# Altium schematic sheet HVSUP_channel.SchDoc
size A4
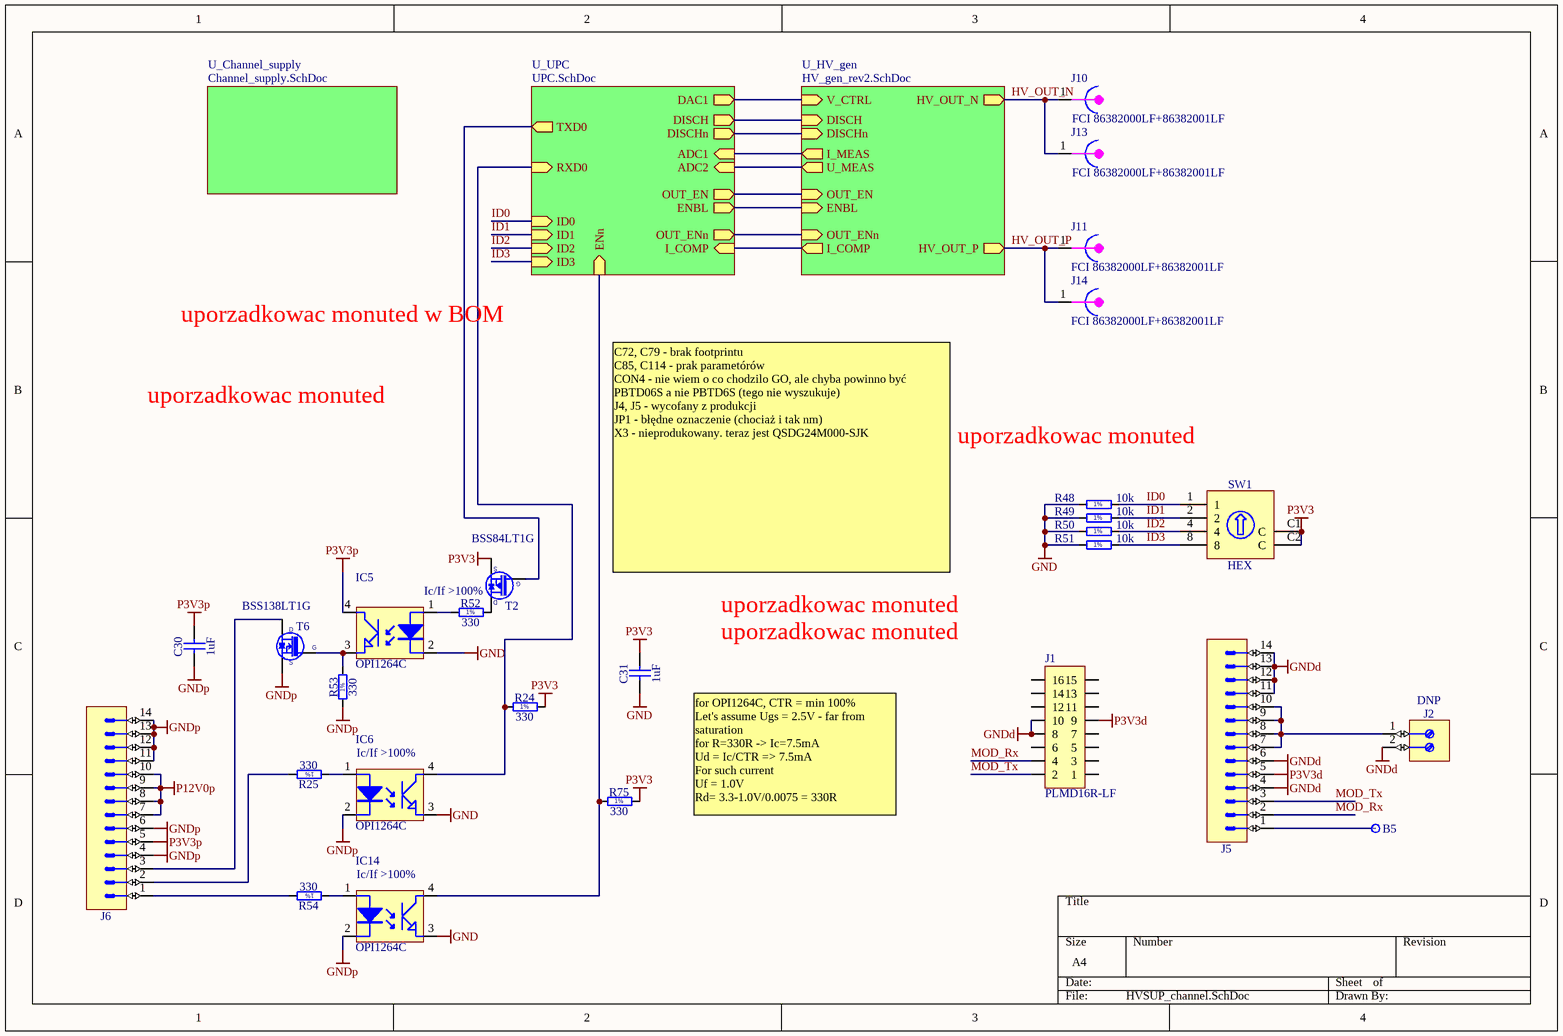
[diagram p0: HVSUP_channel.SchDoc]

## Parts
B5  Plated Hole  [c130h80]  (value not drawn)
C30  1uF  [CAPC1005X55N]
C31  1uF  [CAPC1005X55N]
IC5  OPI1264C  [OPI1264C]
IC6  OPI1264C  [OPI1264C]
IC14  OPI1264C  [OPI1264C]
J1  PLMD16R-LF  [PLMD16R-LF]
J2  DNP  [PHOENIX_1725656]
J5  Header 14  [3M_N2514-5002RB]  (value not drawn)
J6  Header 14  [3M_N2514-5002RB]  (value not drawn)
J10  FCI 86382000LF+86382001LF  [FCI_86382000LF]
J11  FCI 86382000LF+86382001LF  [FCI_86382000LF]
J13  FCI 86382000LF+86382001LF  [FCI_86382000LF]
J14  FCI 86382000LF+86382001LF  [FCI_86382000LF]
R24  330  [RESC1005X40N]
R25  330  [RESC1005X40N]
R48  10k  [RESC1005X40N]
R49  10k  [RESC1005X40N]
R50  10k  [RESC1005X40N]
R51  10k  [RESC1005X40N]
R52  330  [RESC1005X40N]
R53  330  [RESC1005X40N]
R54  330  [RESC1005X40N]
R75  330  [RESC1005X40N]
SW1  HEX  [SW_OMRON_A6RV-162RF]
T2  BSS84LT1G  [SOT95P240X110-3N]
T6  BSS138LT1G  [SOT95P240X110-3N]

## Sub-sheets
U_Channel_supply = Channel_supply.SchDoc: no entries
U_HV_gen = HV_gen_rev2.SchDoc: HV_OUT_P (out), HV_OUT_N (out), ENBL (in), V_CTRL (in), I_MEAS (out), U_MEAS (out), OUT_EN (in), OUT_ENn (in), I_COMP (out), DISCH (in), DISCHn (in)
U_UPC = UPC.SchDoc: ADC1 (in), ADC2 (in), DAC1 (out), TXD0 (out), RXD0 (in), ENBL (out), ID0 (in), ID1 (in), ID2 (in), ID3 (in), OUT_EN (out), ENn (in), OUT_ENn (out), I_COMP (in), DISCH (out), DISCHn (out)

## Nets
GND: C31.1 IC5.2(K) IC6.3(E) IC14.3(E) R48.1 R49.1 R50.1 R51.1
GNDd: J1.8 J1.10 J2.2 J5.4 J5.6 J5.11 J5.12 J5.13 J5.14
GNDp: C30.1 IC6.2(K) IC14.2(K) J6.4 J6.6 J6.11 J6.12 J6.13 J6.14 R53.1 T6.2(S)
P3V3: C31.2 R24.2 R75.2 SW1.C1(C) SW1.C2(C) T2.2(S)
P3V3d: J1.9 J5.5
P3V3p: C30.2 IC5.4(C) J6.5
P12V0p: J6.7 J6.8 J6.9 J6.10
HV_OUT_N: J10.1 J13.1 ; sheet U_HV_gen/HV_OUT_N
HV_OUT_P: J11.1 J14.1 ; sheet U_HV_gen/HV_OUT_P
ID0: R48.2 SW1.1 ; sheet U_UPC/ID0
ID1: R49.2 SW1.2 ; sheet U_UPC/ID1
ID2: R50.2 SW1.4 ; sheet U_UPC/ID2
ID3: R51.2 SW1.8 ; sheet U_UPC/ID3
MOD_Rx: J1.4 J5.2
MOD_Tx: J1.2 J5.3
NetB5_1: B5.1 J5.1
NetIC5_1: IC5.1(A) R52.1
NetIC5_3: IC5.3(E) R53.2 T6.1(G)
NetIC6_1: IC6.1(A) R25.1
NetIC6_4: IC6.4(C) R24.1 ; sheet U_UPC/RXD0
NetIC14_1: IC14.1(A) R54.1
NetIC14_4: IC14.4(C) R75.1 ; sheet U_UPC/ENn
NetJ2_1: J2.1 J5.7 J5.8 J5.9 J5.10
NetJ6_1: J6.1 R54.2
NetJ6_2: J6.2 R25.2
NetJ6_3: J6.3 T6.3(D)
NetR52_2: R52.2 T2.3(D)
NetT2_1: T2.1(G) ; sheet U_UPC/TXD0
(unnamed): sheet U_UPC/ADC1, sheet U_HV_gen/I_MEAS
(unnamed): sheet U_UPC/ADC2, sheet U_HV_gen/U_MEAS
(unnamed): sheet U_UPC/DAC1, sheet U_HV_gen/V_CTRL
(unnamed): sheet U_UPC/ENBL, sheet U_HV_gen/ENBL
(unnamed): sheet U_UPC/OUT_EN, sheet U_HV_gen/OUT_EN
(unnamed): sheet U_UPC/OUT_ENn, sheet U_HV_gen/OUT_ENn
(unnamed): sheet U_UPC/I_COMP, sheet U_HV_gen/I_COMP
(unnamed): sheet U_UPC/DISCH, sheet U_HV_gen/DISCH
(unnamed): sheet U_UPC/DISCHn, sheet U_HV_gen/DISCHn

Not connected (* = marked no-connect by the designer): J1 1 3 5 6 7 11 12 13 14 15 16

## Notes on the sheet
- uporzadkowac monuted w BOM
- uporzadkowac monuted
- C72, C79 - brak footprintu
  C85, C114 - prak parametórów
  CON4 - nie wiem o co chodzilo GO, ale chyba powinno być PBTD06S a nie PBTD6S (tego nie wyszukuje)
  J4, J5 - wycofany z produkcji
  JP1 - błędne oznaczenie (chociaż i tak nm)
  X3 - nieprodukowany. teraz jest QSDG24M000-SJK
- for OPI1264C, CTR = min 100%
  Let's assume Ugs = 2.5V - far from saturation
  for R=330R -> Ic=7.5mA
  Ud = Ic/CTR => 7.5mA
  For such current
  Uf = 1.0V
  Rd= 3.3-1.0V/0.0075 = 330R
- (in symbol OPTO-OPI1264C) Ic/If >100%
- (in symbol R0402_10K_1%_0.0625W_100PPM) 1%
- (in symbol R0402_330R_1%_0.0625W_100PPM) 1%

## Library data of the parts
B5 = PLATED_HOLE0.8_PAD1.3: Single Terminal Socket; Part Description: Plated Through Hole: Hole Dia.=0.8mm Pad Dia.=1.3mm; Mounted: No; Part Number: PLATED_HOLE0.8_PAD1.3; Component Kind: Standard (No BOM); Component Type: Standard (No BOM); Pin Count: 1; Family: Plated Hole; Socket: No; SMD: No; Sense: No; Status: None; ComponentHeight: 0mm; HelpURL: Undefined; Author: CERN DEM JLC; CreateDate: 2008-10-30; LatestRevisionDate: 2008-10-30; PackageDescription: Plated Through Hole: Hole Dia.=0.8mm Pad Dia.=1.3mm
C30 C31 = CC0402_1UF_16V_10%_X5R: Non-polarised capacitor; Part Description: SMD Multilayer Chip Ceramic Capacitor; Manufacturer: GENERIC; Manufacturer1 Part Number: C1005X5R1C105KT; Voltage: 16V; TC: X5R; Tolerance: ±10%; Part Number: CC0402_1UF_16V_10%_X5R; Component Kind: Standard; Component Type: Standard; Pin Count: 2; Value: 1uF; Status: Preferred; Manufacturer Part Number: CC0402_1UF_16V_10%_X5R; Case: 0402; Mounted: Yes; Socket: No; SMD: Yes; Sense: No; Manufacturer1 Example: TDK; Manufacturer1 ComponentHeight: 0.55mm; HelpURL: \\cern.ch\dfs\Applications\Altium\Datasheets\CC0402_X5R_TDK_C.pdf; Author: CERN DEM JLC; CreateDate: 2012-10-25; LatestRevisionDate: 2012-10-25
IC5 IC6 IC14 = OPTO-OPI1264C: 10kV opto-coupler; Supplier 1: Newark; Supplier Part Number 1: 08F2863
J1 = CON_2x8 2mm_RA_male: 2mm  dual row goldpin (Maritex)
J2 = PHOENIX_1725656: Terminal Block, 2 Positions, Screw Connection; Part Description: 6A, 63V, Terminal Block, Pitch 2.54mm, 2 Positions, Screw Connection; Manufacturer: PHOENIX CONTACT; Manufacturer Part Number: 1725656 (MPT 0,5/2-2,54); PressFit: No; Part Number: PHOENIX_1725656; Component Kind: Standard; Component Type: Standard; Pin Count: 2; Mounted: Yes; Socket: No; SMD: No; Sense: No; Status: None; ComponentHeight: 8.5mm; HelpURL: \\cern.ch\dfs\Applications\Altium\Datasheets\PHOENIX_1725656.pdf; Author: CERN DEM JMW; CreateDate: 2008-11-07; LatestRevisionDate: 2010-04-26
J5 J6 = 3M_N2514-5002RB: Connector 14 Male; Part Description: 14 Contacts - Right Angle .100" x .100" Low Profile Four-Wall Header, 2500 Series; Manufacturer: 3M; PressFit: No; Part Number: 3M_N2514-5002RB; Component Kind: Standard; Component Type: Standard; Pin Count: 14; Family: Header 14; Mounted: Yes; Socket: No; SMD: No; Sense: No; Status: None; Manufacturer Part Number: N2514-5002RB; ComponentHeight: 8.59mm; HelpURL: \\cern.ch\dfs\Applications\Altium\Datasheets\3M_N2514-5002RB.pdf; Author: CERN DEM JLC; CreateDate: 2008-10-29; LatestRevisionDate: 2012-01-16
J10 J11 J13 J14 = CON_HV_DSUB_PIN: D-SUB HIGH VOLTAGE CONTACT PIN
R24 R25 R52-R54 R75 = R0402_330R_1%_0.0625W_100PPM: Resistor - 1%; Part Description: General Purpose Thick Film Chip Resistor; Manufacturer: GENERIC; Manufacturer1 Part Number: 232270673301L; TC: ±100ppm/°C; Part Number: R0402_330R_1%_0.0625W_100PPM; Component Kind: Standard; Component Type: Standard; Pin Count: 2; Value: 330; Status: Not recommended; Power: 0.0625W; Tolerance: ±1%; Manufacturer Part Number: R0402_330R_1%_0.0625W_100PPM; Case: 0402; Mounted: Yes; Sense: No; Socket: No; SMD: Yes; Manufacturer1 Example: YAGEO PHYCOMP; Manufacturer1 ComponentHeight: 0.4mm; HelpURL: \\cern.ch\dfs\Applications\Altium\Datasheets\R0402_Phycomp_RC0402.pdf; Author: CERN DEM JLC; CreateDate: 2007-12-03; LatestRevisionDate: 2012-10-17
R48-R51 = R0402_10K_1%_0.0625W_100PPM: Resistor - 1%; Part Description: General Purpose Thick Film Chip Resistor; Manufacturer: GENERIC; Manufacturer1 Part Number: 232270671003L; TC: ±100ppm/°C; Part Number: R0402_10K_1%_0.0625W_100PPM; Component Kind: Standard; Component Type: Standard; Pin Count: 2; Value: 10k; Status: Not recommended; Power: 0.0625W; Tolerance: ±1%; Manufacturer Part Number: R0402_10K_1%_0.0625W_100PPM; Case: 0402; Mounted: Yes; Sense: No; Socket: No; SMD: Yes; Manufacturer1 Example: YAGEO PHYCOMP; Manufacturer1 ComponentHeight: 0.4mm; HelpURL: \\cern.ch\dfs\Applications\Altium\Datasheets\R0402_Phycomp_RC0402.pdf; Author: CERN DEM JLC; CreateDate: 2007-12-03; LatestRevisionDate: 2012-10-17
SW1 = SW_OMRON_A6RV-162RF: Rotary Code Switch 1 2 4 8 C1 C2; Part Number: SW_OMRON_A6RV-162RF or ERD716RR; Part Description: Side Actuated, Hexadecimal Rotary Code Switch; Manufacturer: OMRON; Manufacturer Part Number: A6RV-162RF or ERD716RR; PressFit: No; Component Kind: Standard; Component Type: Standard; Pin Count: 6; PackageDescription: Body 9.8x6.64mm, Side Actuated, Rotary Code Switch, OMRON A6RV Series; Family: HEX; Mounted: Yes; Socket: No; SMD: No; Sense: No; Status: None; ComponentHeight: 9.9mm; HelpURL: \\cern.ch\dfs\Applications\Altium\Datasheets\SW_OMRON_A6RV.pdf; Author: CERN DEM JLC; CreateDate: 2008-11-27; LatestRevisionDate: 2011-01-19
T2 = BSS84LT1G: P-CHANNEL MOSFET WITH DIODE; Part Description: 50V 130mA Single P-Channel Power MOSFET; Manufacturer: ON SEMICONDUCTOR; PressFit: No; Bonding: No; Part Number: BSS84LT1G; Component Kind: Standard; Component Type: Standard; Device: BSS84LT1G; PackageDescription: SOT23 3-Leads, Pitch 0.95mm - Body 1.4x3mm, IPC Medium Density; Manufacturer Part Number: BSS84LT1G; Pin Count: 3; Case: SOT23-3; Mounted: Yes; Socket: No; SMD: Yes; Sense: No; ComponentHeight: 1.1mm; HelpURL: \\cern.ch\dfs\Applications\Altium\Datasheets\BSS84LT1G.pdf; Author: CERN DEM JLC; CreateDate: 2012-03-29; LatestRevisionDate: 2012-03-29
T6 = BSS138LT1G: N-CHANNEL MOSFET WITH DIODE; Part Description: 50V 200mA N-Channel Enhancement Mode Field-Effect Transistor; Manufacturer: ON SEMICONDUCTOR; PressFit: No; Bonding: No; Part Number: BSS138LT1G; Component Kind: Standard; Component Type: Standard; Device: BSS138LT1G; PackageDescription: SOT23 3-Leads, Pitch 0.95mm - Body 1.4x3mm, IPC Medium Density; Manufacturer Part Number: BSS138LT1G; Pin Count: 3; Case: SOT23-3; Mounted: Yes; Socket: No; SMD: Yes; Sense: No; ComponentHeight: 1.11mm; HelpURL: \\cern.ch\dfs\Applications\Altium\Datasheets\BSS138LT1G.pdf; Author: CERN DEM JLC; CreateDate: 2009-03-23; LatestRevisionDate: 2009-03-23